# Altium schematic sheet sar20-afbr-s50-adapter.SchDoc
size A4; SheetNumber: 1; SheetTotal: 1
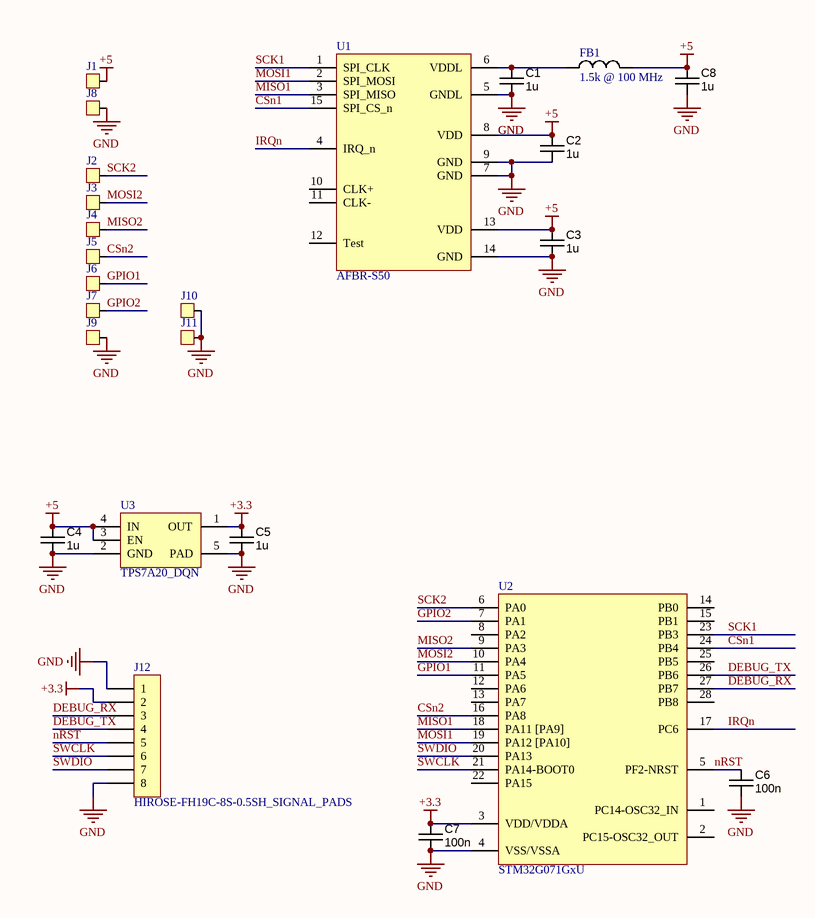
[diagram p0: sar20-afbr-s50-adapter.SchDoc]

## Parts
C1  1u  [CAPC1005X55N]
C2  1u  [CAPC1005X55N]
C3  1u  [CAPC1005X55N]
C4  1u  [CAPC1005X55N]
C5  1u  [CAPC1005X55N]
C6  value 100n  [CAPC0603X04N]  (hidden comment: CAPC_100n_0201)
C7  value 100n  [CAPC0603X04N]  (hidden comment: CAPC_100n_0201)
C8  1u  [CAPC1005X55N]
FB1  1.5k @ 100 MHz  [RESC1005X40N]
J1  SOLDER-PAD  [PAD-0610]  (value not drawn)
J2  SOLDER-PAD  [PAD-0610]  (value not drawn)
J3  SOLDER-PAD  [PAD-0610]  (value not drawn)
J4  SOLDER-PAD  [PAD-0610]  (value not drawn)
J5  SOLDER-PAD  [PAD-0610]  (value not drawn)
J6  SOLDER-PAD  [PAD-0610]  (value not drawn)
J7  SOLDER-PAD  [PAD-0610]  (value not drawn)
J8  SOLDER-PAD  [PAD-0610]  (value not drawn)
J9  SOLDER-PAD  [PAD-0610]  (value not drawn)
J10  SOLDER-PAD  [PAD-0610]  (value not drawn)
J11  SOLDER-PAD  [PAD-0610]  (value not drawn)
J12  HIROSE-FH19C-8S-0.5SH_SIGNAL_PADS  [HIROSE-FH19C-8S-0.5SH_SIGNAL_PADS]
U1  AFBR-S50  [AFBR-S50]
U2  STM32G071GxU  [QFN50P400X400X60-28N]
U3  TPS7A20_DQN  [TI_X2SON_DQN0004A]

## Nets
+3.3: C5.2 C7.2 J12.2 U2.3(VDD/VDDA) U3.1(OUT)
+5: C2.2 C3.2 C4.2 C8.2 FB1.2 J1.1 U1.8(VDD) U1.13(VDD) U3.3(EN) U3.4(IN)
GND: C1.1 C2.1 C3.1 C4.1 C5.1 C6.1 C7.1 C8.1 J8.1 J9.1 J10.1 J11.1 J12.1 J12.8 U1.5(GNDL) U1.7(GND) U1.9(GND) U1.14(GND) U2.4(VSS/VSSA) U3.2(GND) U3.5(PAD)
CSn1: U1.15(SPI_CS_n) U2.24(PB4)
CSn2: J5.1 U2.16(PA8)
DEBUG_RX: J12.3 U2.27(PB7)
DEBUG_TX: J12.4 U2.26(PB6)
GPIO1: J6.1 U2.11(PA5)
GPIO2: J7.1 U2.7(PA1)
IRQn: U1.4(IRQ_n) U2.17(PC6)
MISO1: U1.3(SPI_MISO) U2.18(PA11_[PA9])
MISO2: J4.1 U2.9(PA3)
MOSI1: U1.2(SPI_MOSI) U2.19(PA12_[PA10])
MOSI2: J3.1 U2.10(PA4)
nRST: C6.2 J12.5 U2.5(PF2-NRST)
SCK1: U1.1(SPI_CLK) U2.23(PB3)
SCK2: J2.1 U2.6(PA0)
SWCLK: J12.6 U2.21(PA14-BOOT0)
SWDIO: J12.7 U2.20(PA13)
NetC1_2: C1.2 FB1.1 U1.6(VDDL)

Not connected (* = marked no-connect by the designer): U1 10(CLK+) 11(CLK-) 12(Test); U2 1(PC14-OSC32_IN) 2(PC15-OSC32_OUT) 8(PA2) 12(PA6) 13(PA7) 14(PB0) 15(PB1) 22(PA15) 25(PB5) 28(PB8)

## Library data of the parts
C1-C5 C8 = CAPC_100n_0402_X5R_16V_10%: Capacitor SMD Cer 100nF 10% 16V X5R 0402; Manufacturer 1: AVX Corporation; Manufacturer Part Number 1: 0402YD104KAT2A; Ratings: 16V; X5R; SCDType: spec; Tolerance: ±10%; Operating Temperature: -55°C ~ 125°C; Package / Case: 0402 (1005 Metric); Size / Dimension: 0.039" L x 0.020" W (1.00mm x 0.50mm); Supplier 1: Digi-Key; Supplier Part Number 1: 478-1126-1-ND; ComponentLink1URL: http://www.avx.com/docs/Catalogs/cx5r.pdf; ComponentLink1Description: http://www.avx.com/docs/Catalogs/cx5r.pdf; Supplier 2: Digi-Key; Supplier Part Number 2: 311-1347-1-ND; Manufacturer 2: Yageo; Manufacturer Part Number 2: CC0402KRX5R7BB104; ComponentLink2URL: http://www.yageo.com/documents/recent/UPY-GPHC_X5R_4V-to-50V_12.pdf; ComponentLink2Description: http://www.yageo.com/documents/recent/UPY-GPHC_X5R_4V-to-50V_12.pdf; Value: 1u
FB1 = FERRITE_BEAD: Value: 1.5k @ 100 MHz